# Altium schematic sheet ad-dc-1.SchDoc
size A2; Organization: Protel International P/L; Address1: L3, 12a Rodborough Rd; Address2: Frenchs Forest; Address3: NSW; Address4: Australia 2086
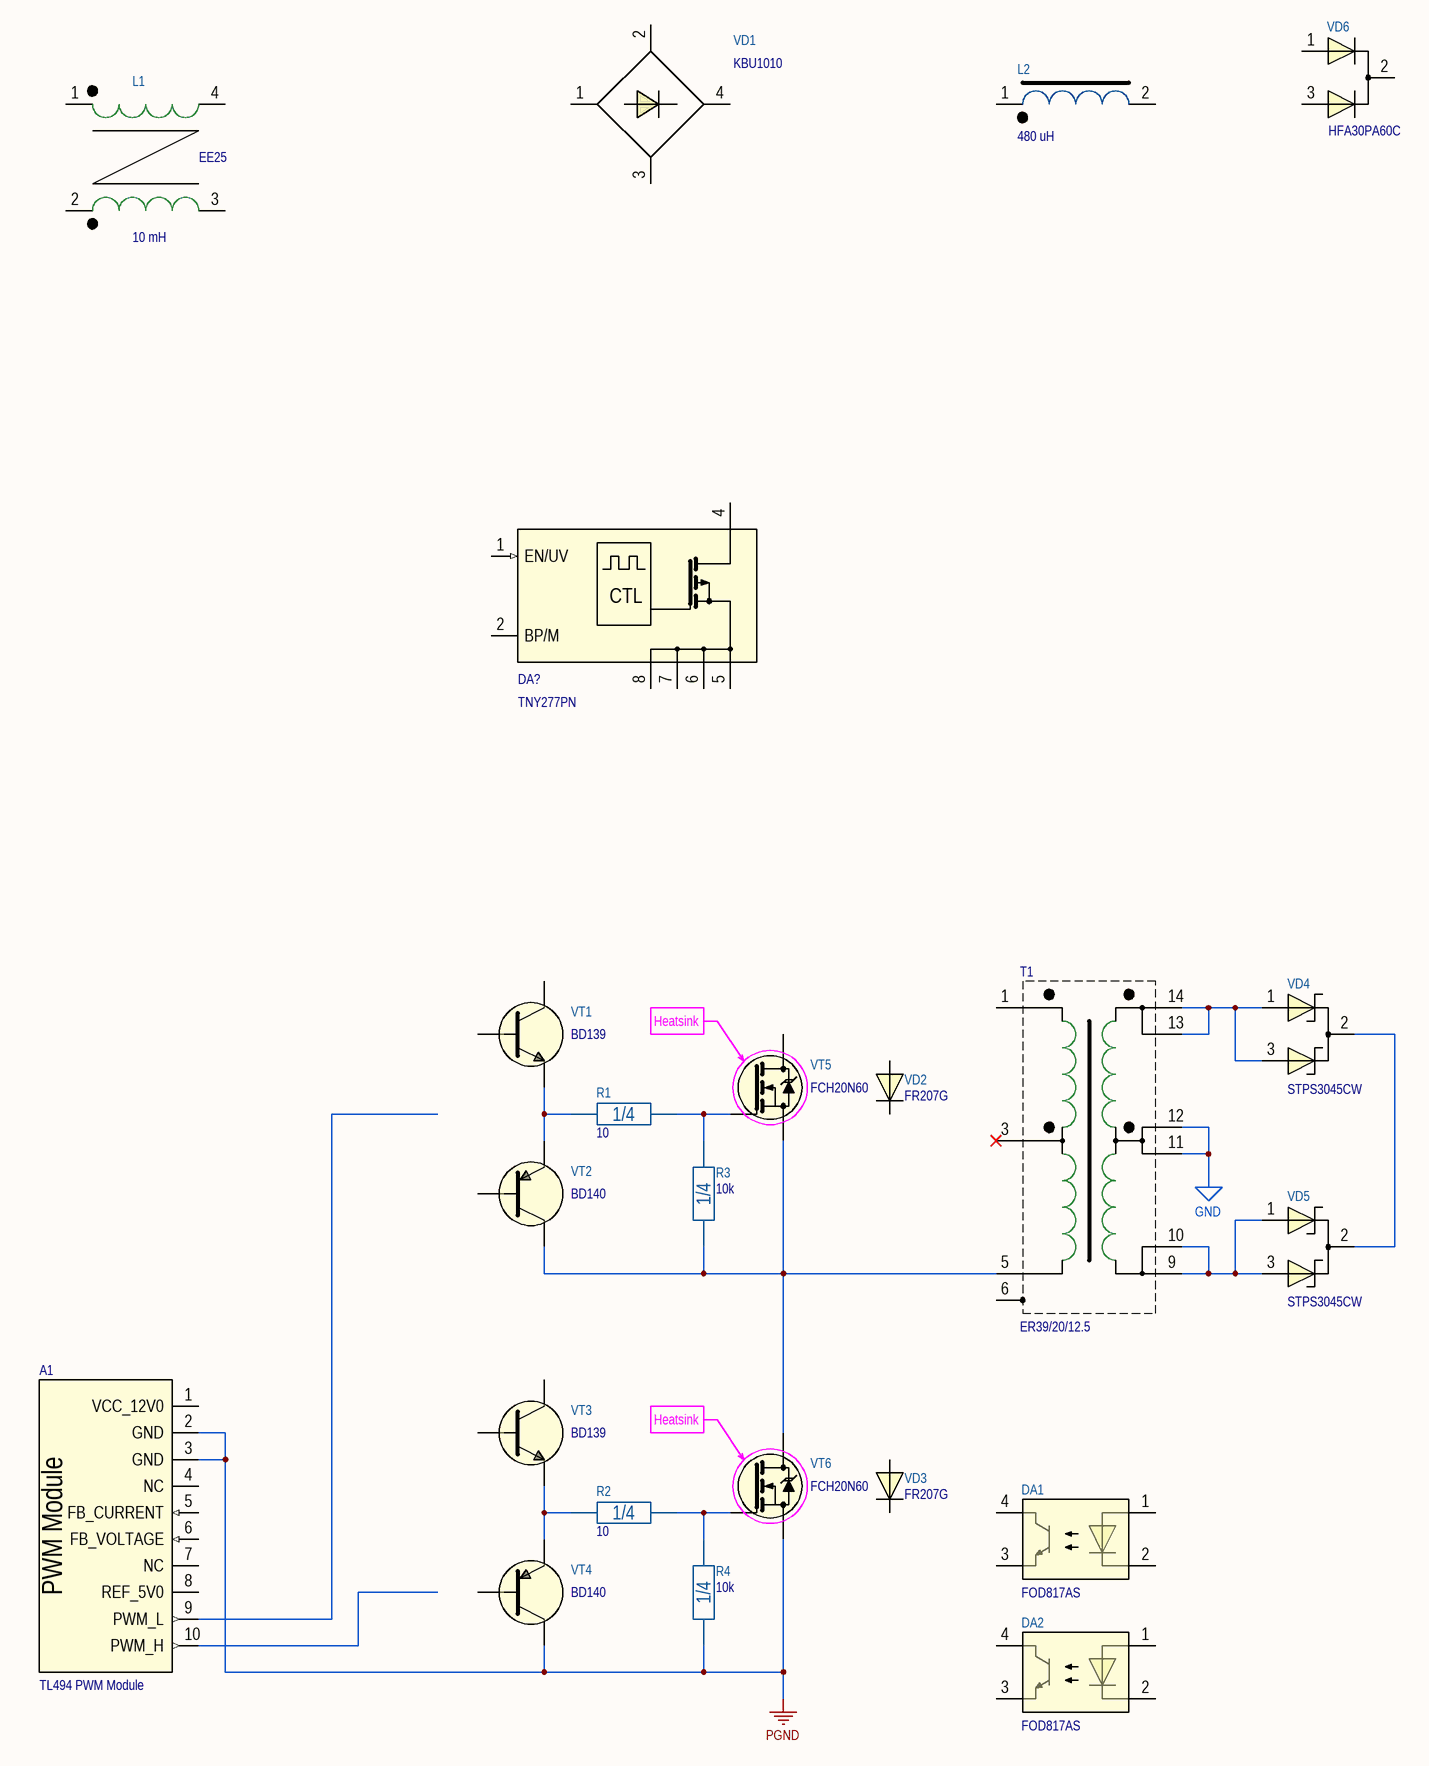
[diagram p0: ad-dc-1.SchDoc]

## Parts
A1  TL494 PWM Module  [PWM-TL494]
DA1  FOD817AS  [N04C]
DA2  FOD817AS  [N04C]
DA?  TNY277PN  [DIP-8C]
L1  10 mH  [EE25/10/6]
L2  480 uH  [CORE_D36_GB]
R1  10  Package: 1/4  [CFR-25(VERTICAL)]
R2  10  Package: 1/4  [CFR-25(VERTICAL)]
R3  10k  Package: 1/4  [CFR-25]
R4  10k  Package: 1/4  [CFR-25]
T1  ER39/20/12.5  [ER39/20/12.5]
VD1  KBU1010  [KBU1010]
VD2  FR207G  [DO-15]
VD3  FR207G  [DO-15]
VD4  STPS3045CW  [TO-247_with_TO-220 (VERTICAL)]
VD5  STPS3045CW  [TO-247_with_TO-220 (VERTICAL)]
VD6  HFA30PA60C  [TO-247 ((HORIZONTAL, BOTTOM)]
VT1  BD139  [TO-126 (VERTICAL)]
VT2  BD140  [TO-126 (VERTICAL)]
VT3  BD139  [TO-126 (VERTICAL)]
VT4  BD140  [TO-126 (VERTICAL)]
VT5  FCH20N60  [TO-247_with_TO-220 (VERTICAL)]
VT6  FCH20N60  [TO-247_with_TO-220 (VERTICAL)]

## Nets
GND: T1.11 T1.12
PGND: A1.2(GND) A1.3(GND) R4.1 VT4.2(C) VT6.3(S)
NetR1_1: R1.1 R3.2 VT5.1(G)
NetR1_2: R1.2 VT1.3(E) VT2.3(E)
NetR2_1: R2.1 R4.2 VT6.1(G)
NetR2_2: R2.2 VT3.3(E) VT4.3(E)
NetR3_1: R3.1 T1.5 VT2.2(C) VT5.3(S) VT6.2(D)
NetT1_9: T1.9 T1.10 VD5.1(A1) VD5.3(A2)
NetT1_13: T1.13 T1.14 VD4.1(A1) VD4.3(A2)
NetVD4_2: VD4.2(C) VD5.2(C)

Not connected (* = marked no-connect by the designer): A1 1(VCC_12V0) 4(NC) 5(FB_CURRENT) 6(FB_VOLTAGE) 7(NC) 8(REF_5V0) 9(PWM_L) 10(PWM_H); DA1 1(ANODE) 2(CATHODE) 3(EMITTER) 4(COLLECTOR); DA2 1(ANODE) 2(CATHODE) 3(EMITTER) 4(COLLECTOR); DA? 1(EN/UV) 2(BP/M) 4(DRAIN) 5(SOURCE) 6(SOURCE) 7(SOURCE) 8(SOURCE); L1 1 2 3 4; L2 1 2; T1 1 3* 6; VD1 1(M) 2(AC1) 3(AC2) 4(P); VD2 1(C) 2(A); VD3 1(C) 2(A); VD6 1(A1) 2(C) 3(A2); VT1 1(B) 2(C); VT2 1(B); VT3 1(B) 2(C); VT4 1(B); VT5 2(D)

## Notes on the sheet
- Heatsink
- Title
- Size:
- Date:
- File:
- A2
- Number:
- Time:
- Revision:
- Sheet
- of
- (in symbol PWM-MODULE) PWM Module
- (in symbol TNY277PN) CTL

## Library data of the parts
A1 = PWM-MODULE: Value: TL494 PWM Module
DA1 DA2 = FOD817AS: Optoisolator 5kV transistor; Manufacturer: ON Semiconductor; Package: 4-SMD (4.1 x 9.86 mm); Part Number: FOD817AS
DA? = TNY277PN: Energy-Effi cient, Off-Line Switcher With Enhanced Flexibility and Extended Power Range; Manufacturer: Power Integrations; Package: DIP-8C; Part Number: TNY277PN
L1 = EE25: EE25 Ferrite Core inductor; Value: 10 mH; Core: EE25
L2 = CORE_D36: Ferrite Core D35.8/22.4/10.5 mm; Core: D36; Value: 480 uH
R1 R2 = CF25: Resistor 1/4W; Part Number: MFR-25FTF52-10R; Manufacturer: Yageo; Tolerance: ± 1 %; Voltage: 250V; Temperature Coefficient: ±100 ppm/°C; Value: 10; Value on schem: 10
R3 R4 = CF25: Resistor 1/4W; Part Number: MFR-25FTF52-10K; Manufacturer: Yageo; Tolerance: ± 1 %; Voltage: 250V; Temperature Coefficient: ±100 ppm/°C; Value: 10k; Value on schem: 10k
T1 = ER39: EE39 Ferrite Core, with footprint for ER35, EE33, EI33 etc.; Value: ER39/20/12.5
VD1 = KBU1010: 10A single phase bridge rectifier; Manufacturer: Won-Top Electronics; Package: KBU; Part Number: KBU1010
VD2 VD3 = FR207G: Diode 2A, 1000V Glass Passivated Fast Recovery Rectifiers; Manufacturer: Taiwan Semiconductor Corporation; Package: DO-15; Part Number: FR207G
VD4 VD5 = STPS3045CW: Power Schottky Rectifier Diode 45V, 2x15A; Manufacturer: STMicroelectronics; Package: TO-247AC; Part Number: STPS3045CW
VD6 = HFA30PA60C: Ultrafast, Soft Recovery Diode 600V, 15A; Manufacturer: Infineon; Package: TO-247AC; Part Number: HFA30PA60C
VT1 VT3 = BD139: General Purpose n-p-n Transistors; Manufacturer: STMicroelectronics; Package: TO-126; Part Number: BD139
VT2 VT4 = BD140: General Purpose p-n-p Transistors; Manufacturer: STMicroelectronics; Package: TO-126; Part Number: BD140
VT5 VT6 = FCH20N60: 600V @ 20A N-Channel MOSFET; Manufacturer: ON Semiconductor; Part Number: FCH20N60; Package: TO-247